# Altium schematic sheet BMS-S05-V01-Isolation.SchDoc: Isolation Barrier
size A3; DrawnBy: Jonn Dillon; DocumentNumber: 3; Revision: 01; SheetNumber: 3; SheetTotal: 10; Version: 01; Project: Battery Management System 2020; PageSetup: Record=PageOptions|CenterHorizontal=True|CenterVertical=True|PrintScale=0.97|XCorrection=1.00|YCorrection=1.00|PrintKind=0|BorderSize=5000000|LeftOffset=0|BottomOffset=0|Orientation=2|PaperLength=1000|PaperWidth=1000|Scale=100|PaperSource=7|PrintQuality=-4|MediaType=1|DitherType=10|PaperKind=A4|PrintScaleMode=1
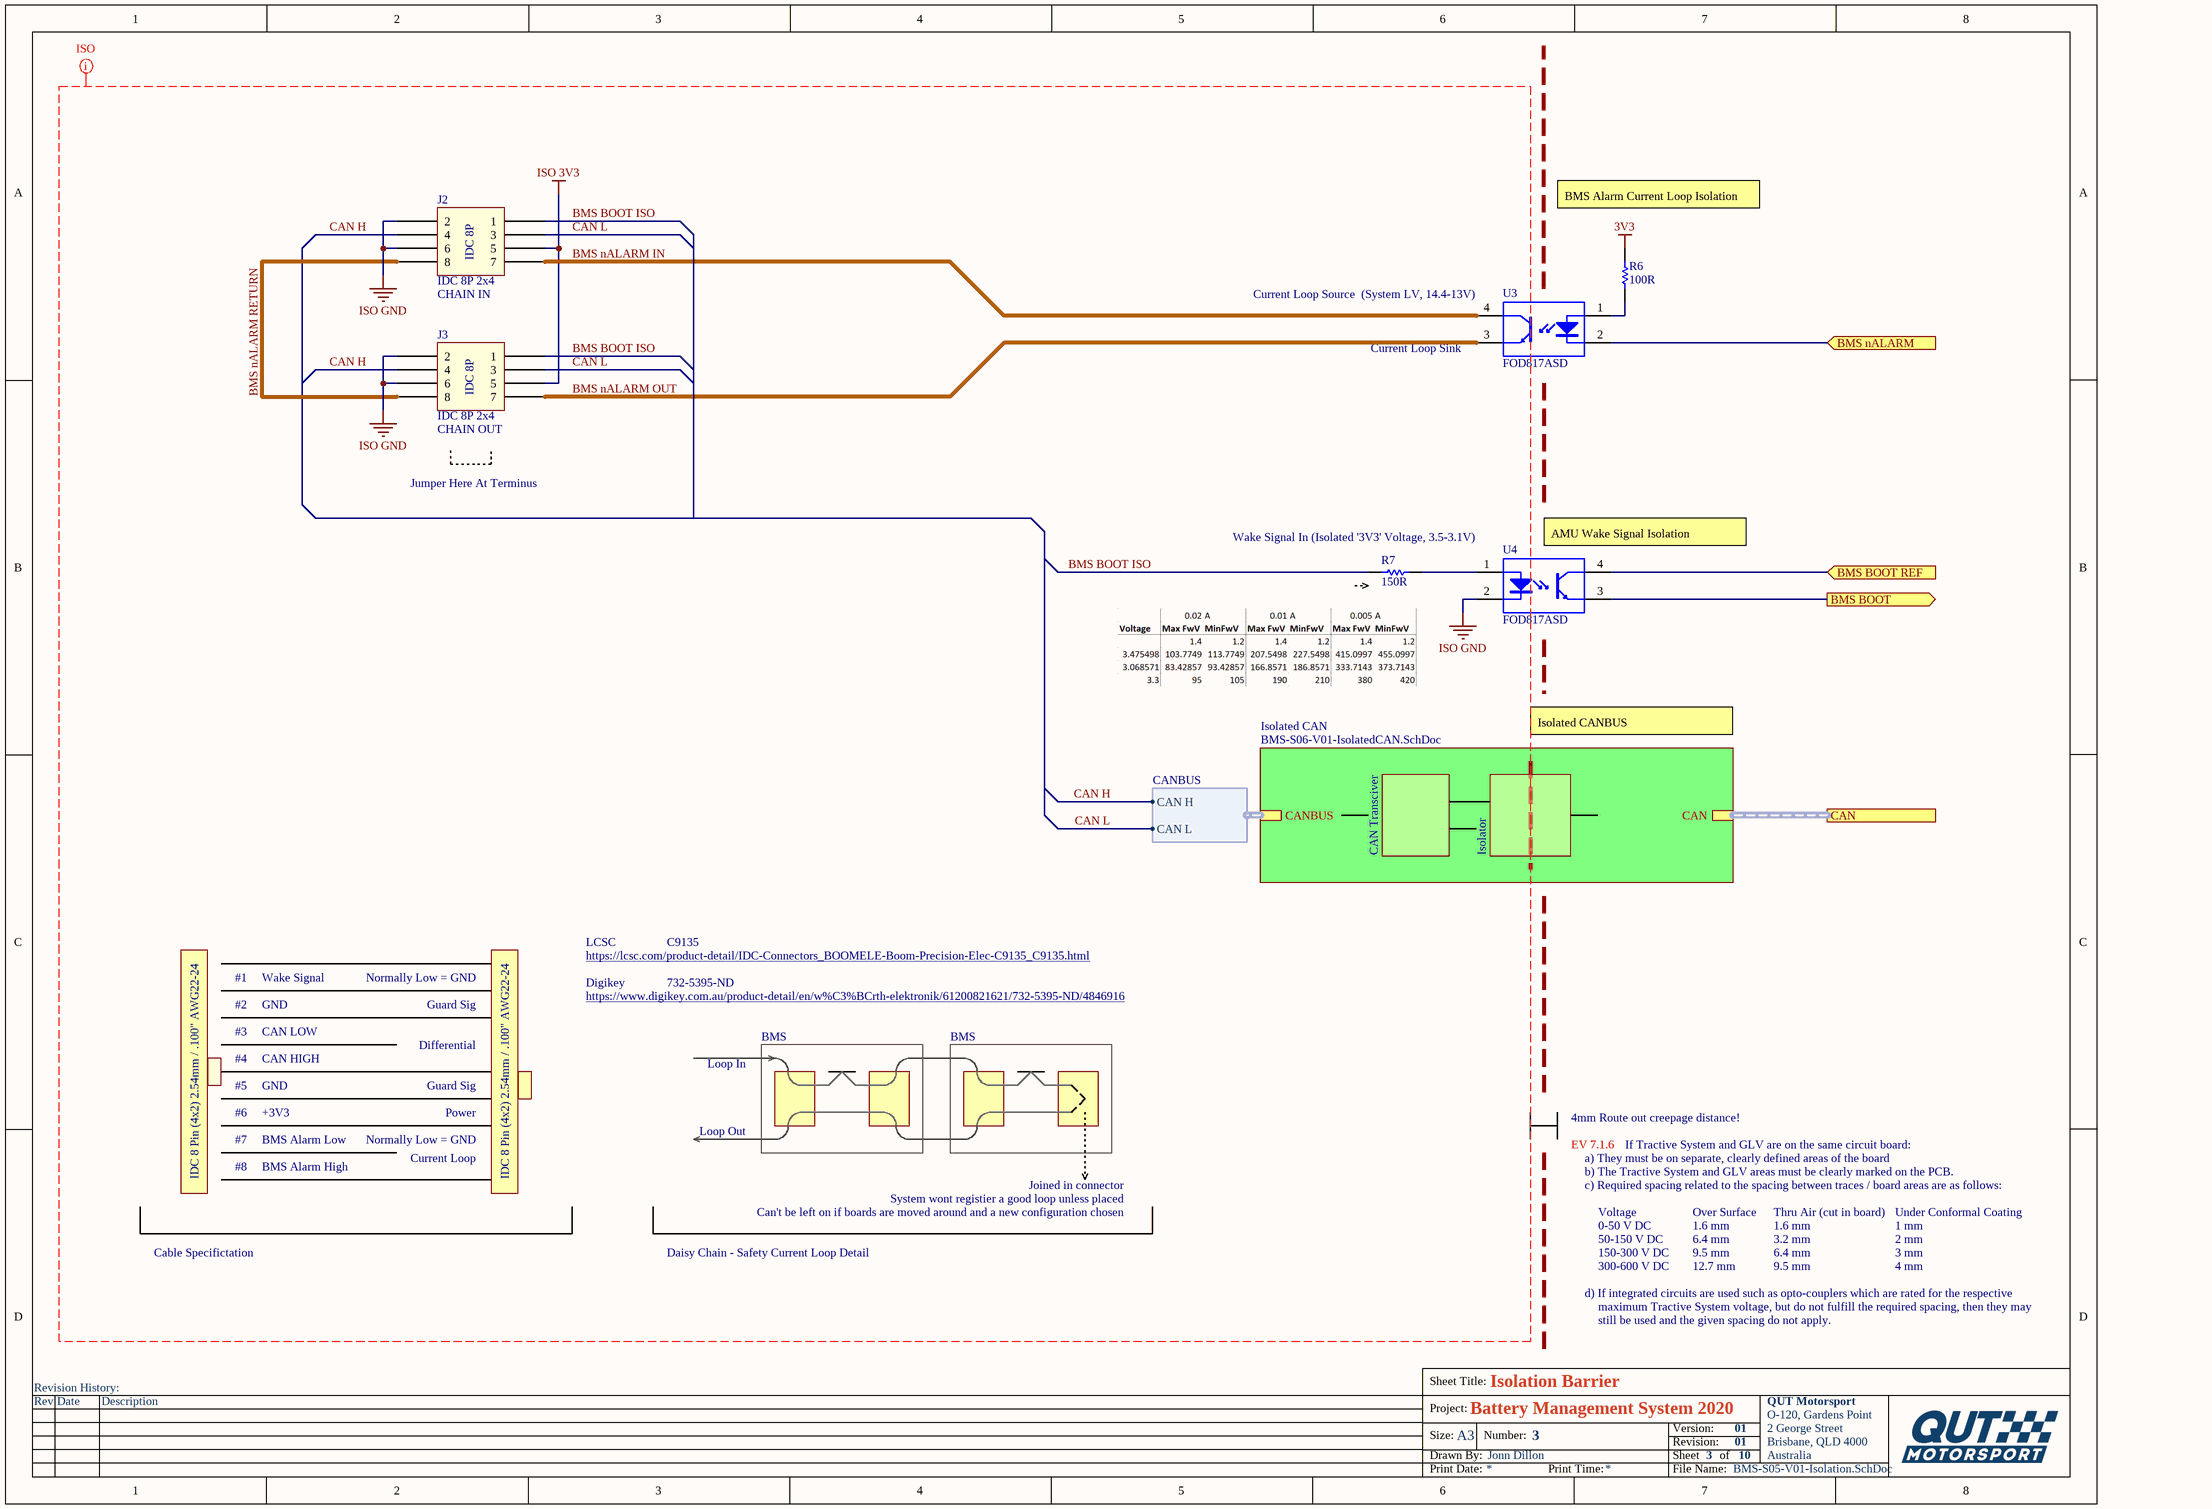
[diagram p0: BMS-S05-V01-Isolation.SchDoc]

## Parts
J2  IDC 8P 2x4  [IDC 2.54MM 8P]
J3  IDC 8P 2x4  [IDC 2.54MM 8P]
R6  100R  [Res_ThinFilm_0603]
R7  150R  [Res_ThinFilm_0603]
U3  FOD817ASD  [FOD817ASD]
U4  FOD817ASD  [FOD817ASD]

## Sub-sheets
Isolated CAN = BMS-S06-V01-IsolatedCAN.SchDoc: CANBUS (harness CANBUS), CAN (harness CAN)

## Ports
BMS BOOT (out), BMS BOOT REF (in), BMS nALARM (in), CAN (harness CAN)

## Harnesses
CANBUS: CAN H, CAN L

## Nets
3V3: R6.2
ISO 3V3: J2.5 J3.5
ISO GND: J2.2 J2.6 J3.2 J3.6 U4.2(CATHODE)
BMS BOOT: U4.3(EMITTER) ; port BMS BOOT
BMS BOOT ISO: J2.1 J3.1 R7.1
BMS BOOT REF: U4.4(COLLECTOR) ; port BMS BOOT REF
BMS nALARM: U3.2(CATHODE) ; port BMS nALARM
BMS nALARM IN: J2.7 U3.4(COLLECTOR)
BMS nALARM OUT: J3.7 U3.3(EMITTER)
BMS nALARM RETURN: J2.8 J3.8
CAN H: J2.4 J3.4 ; sheet Isolated CAN/CANBUS.CAN H
CAN L: J2.3 J3.3 ; sheet Isolated CAN/CANBUS.CAN L
NetR6_1: R6.1 U3.1(ANODE)
NetR7_2: R7.2 U4.1(ANODE)

## Buses and harness runs
harness port CAN = sheet Isolated CAN/CAN

## Layout directives
mark named ISO: BMS BOOT ISO, BMS nALARM IN, BMS nALARM OUT, BMS nALARM RETURN, CAN H, CAN L, ISO 3V3, ISO GND

## Notes on the sheet
- BMS Alarm Current Loop Isolation
- (near J2) CHAIN IN
- (near U3) Current Loop Source  (System LV, 14.4-13V)
- (near U3) Current Loop Sink
- (near J3) CHAIN OUT
- Jumper Here At Terminus
- Wake Signal In (Isolated '3V3' Voltage, 3.5-3.1V)
- (near U4) AMU Wake Signal Isolation
- Isolated CANBUS
- CAN Transciver
- Isolator
- #1
- Wake Signal
- Normally Low = GND
- LCSC
- https://lcsc.com/product-detail/IDC-Connectors_BOOMELE-Boom-Precision-Elec-C9135_C9135.html
- Digikey
- 732-5395-ND
- C9135
- #2
- #3
- #4
- CAN LOW
- CAN HIGH
- GND
- Differential
- Guard Sig
- https://www.digikey.com.au/product-detail/en/w%C3%BCrth-elektronik/61200821621/732-5395-ND/4846916
- BMS
- #5
- #6
- +3V3
- Power
- Loop In
- 4mm Route out creepage distance!
- IDC 8 Pin (4x2) 2.54mm / .100" AWG22-24
- #7
- #8
- BMS Alarm High
- BMS Alarm Low
- Current Loop
- Loop Out
- Joined in connector
- EV 7.1.6
- a) They must be on separate, clearly defined areas of the board
- b) The Tractive System and GLV areas must be clearly marked on the PCB.
- c) Required spacing related to the spacing between traces / board areas are as follows:
- If Tractive System and GLV are on the same circuit board:
- Cable Specifictation
- Daisy Chain - Safety Current Loop Detail
- System wont registier a good loop unless placed
- Can't be left on if boards are moved around and a new configuration chosen
- Voltage
- 0-50 V DC
- 50-150 V DC
- 150-300 V DC
- Over Surface
- 1.6 mm
- 6.4 mm
- 9.5 mm
- Thru Air (cut in board)
- 3.2 mm
- Under Conformal Coating
- 1 mm
- 2 mm
- 3 mm
- d) If integrated circuits are used such as opto-couplers which are rated for the respective
- 300-600 V DC
- maximum Tractive System voltage, but do not fulfill the required spacing, then they may
- still be used and the given spacing do not apply.
- 12.7 mm
- 4 mm
- Revision History:
- Sheet Title:
- Rev
- Date
- Description
- Project:
- Size:
- Drawn By:
- A3
- Number:
- Revision:
- Sheet
- Version:
- of
- QUT Motorsport
- O-120, Gardens Point
- 2 George Street
- Brisbane, QLD 4000
- Australia
- Print Date:
- Print Time:
- File Name:
- (in symbol IDC 8P 2x4) IDC 8P

## Library data of the parts
J2 J3 = IDC 8P 2x4: IDC 8P 2x5
R6 = 100R 5%, 0603: Resistor, SMD, 100R, 0.1W, 5%, 0603
R7 = 150R 5% 0603: Resistor, SMD, 150R, 0.1W, 5%, 0603
U3 U4 = FOD817ASD: Optoisolator 5kV Transistor 4SMD